# Altium project Proyecto0.PrjPcb (part 1 of 3)
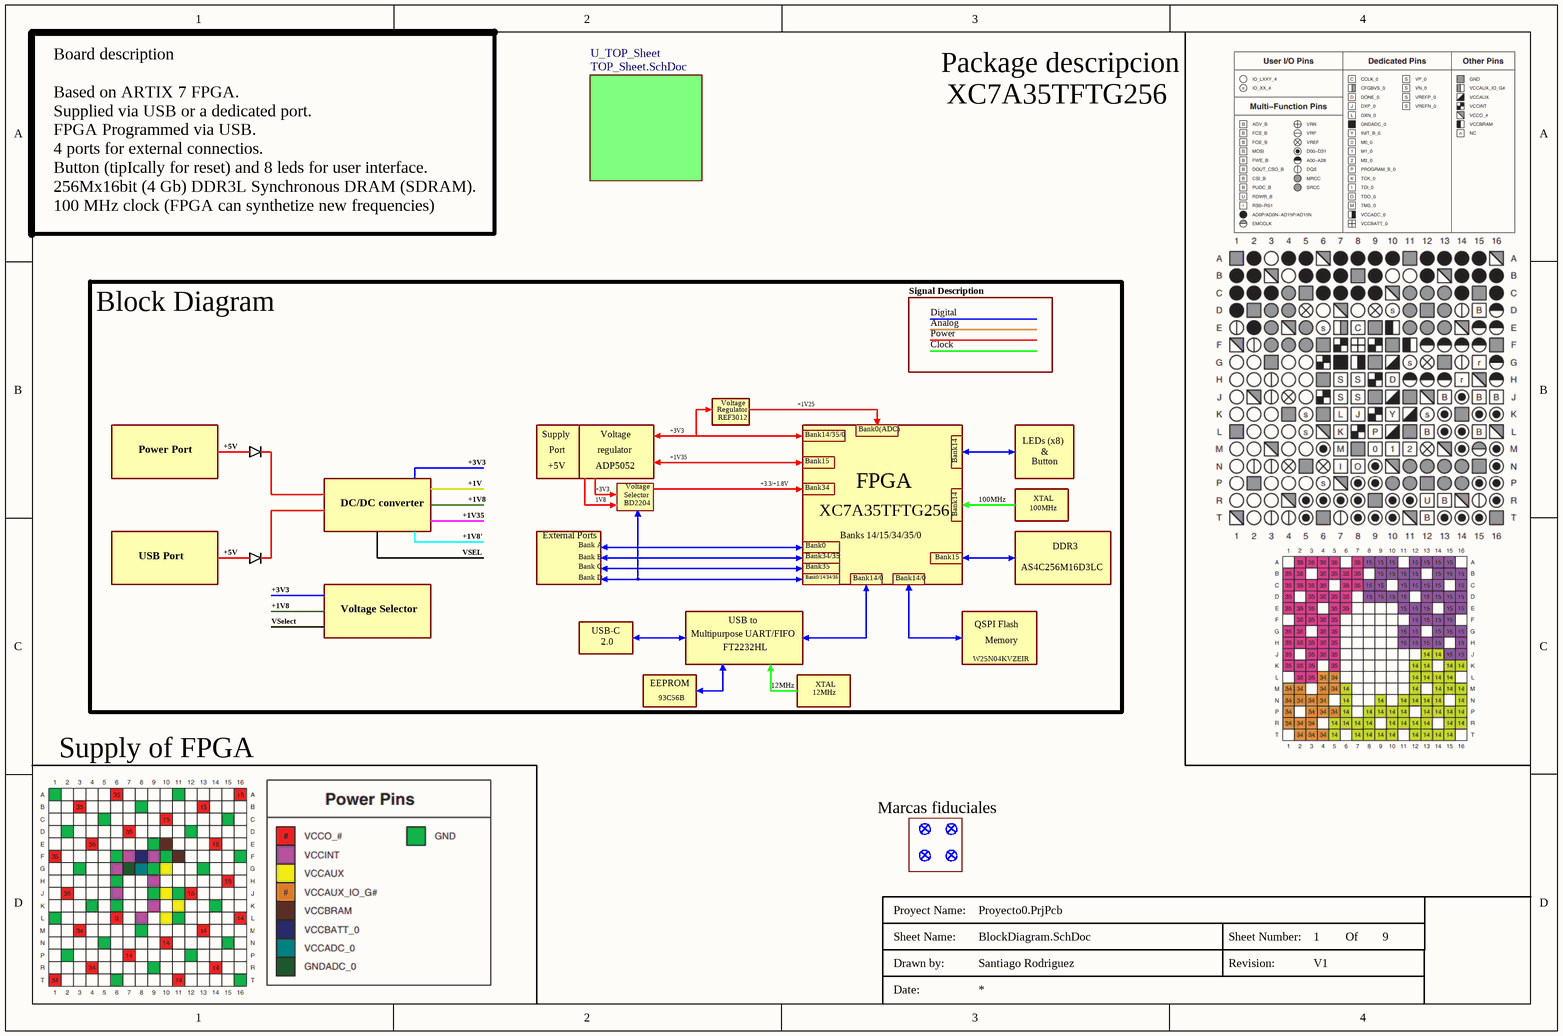
[diagram p0: BlockDiagram.SchDoc]
9 sheets, 188 parts. Net scope: flat (ports and power ports of the same name join across sheets).
Board file: Proyecto_0 - V2.PcbDoc
Sheets:
  BlockDiagram.SchDoc
    U_TOP_Sheet = TOP_Sheet.SchDoc
      U_Bank_A-B-C-D = Bank_A-B-C-D.SchDoc
      U_DDR_Memory = DDR_Memory.SchDoc
      U_Flash_Memory = Flash_Memory.SchDoc
      U_FPGA_Power&Ports = FPGA_Power&Ports.SchDoc
      U_Leds_and_Buttons = Leds_and_Buttons.SchDoc
      U_Power_Supply = Power_Supply.SchDoc
      U_USB_Port_FTT = USB_Port_FTT.SchDoc

## Sheet BlockDiagram.SchDoc
size A4; DrawnBy: Santiago Rodriguez; Revision: V1; SheetNumber: 1; SheetTotal: 9

### Sub-sheets
U_TOP_Sheet = TOP_Sheet.SchDoc: no entries

### Notes on the sheet
- Package descripcion
- XC7A35TFTG256
- Board description
  Based on ARTIX 7 FPGA.
  Supplied via USB or a dedicated port.
  FPGA Programmed via USB.
  4 ports for external connectios.
  Button (tipIcally for reset) and 8 leds for user interface.
  256Mx16bit (4 Gb) DDR3L Synchronous DRAM (SDRAM).
  100 MHz clock (FPGA can synthetize new frequencies)
- Block Diagram
- Signal Description
- Digital
- Power
- Analog
- Clock
- Power Port
- +5V
- Supply
- Port
- regulator
- Voltage
- +3V3
- Regulator
- REF3012
- +1V25
- Bank14/35/0
- Bank0(ADC)
- LEDs (x8)
- DC/DC converter
- +1V35
- +1V
- +1V8
- ADP5052
- 1V8
- Selector
- BD2204
- +3.3/+1.8V
- Bank15
- Bank34
- FPGA
- Bank14
- 100MHz
- Button
- XTAL
- &
- USB Port
- +1V8'
- VSEL
- External Ports
- Bank A
- Bank B
- Bank C
- Bank D
- Bank0
- Bank34/35
- Bank35
- Bank0/14/34/35
- Banks 14/15/34/35/0
- Bank14/0
- AS4C256M16D3LC
- DDR3
- VSelect
- Voltage Selector
- USB-C
- 2.0
- Multipurpose UART/FIFO
- FT2232HL
- USB to
- QSPI Flash
- Memory
- EEPROM
- 93C56B
- 12MHz
- W25N04KVZEIR
- Supply of FPGA
- Marcas fiduciales
- Proyect Name:
- Sheet Name:
- Drawn by:
- Revision:
- Sheet Number:
- Of
- Date:

## Sheet TOP_Sheet.SchDoc
size 431 x 279 mm; DrawnBy: Santiago Rodriguez; Revision: V1; SheetNumber: 2; SheetTotal: 9
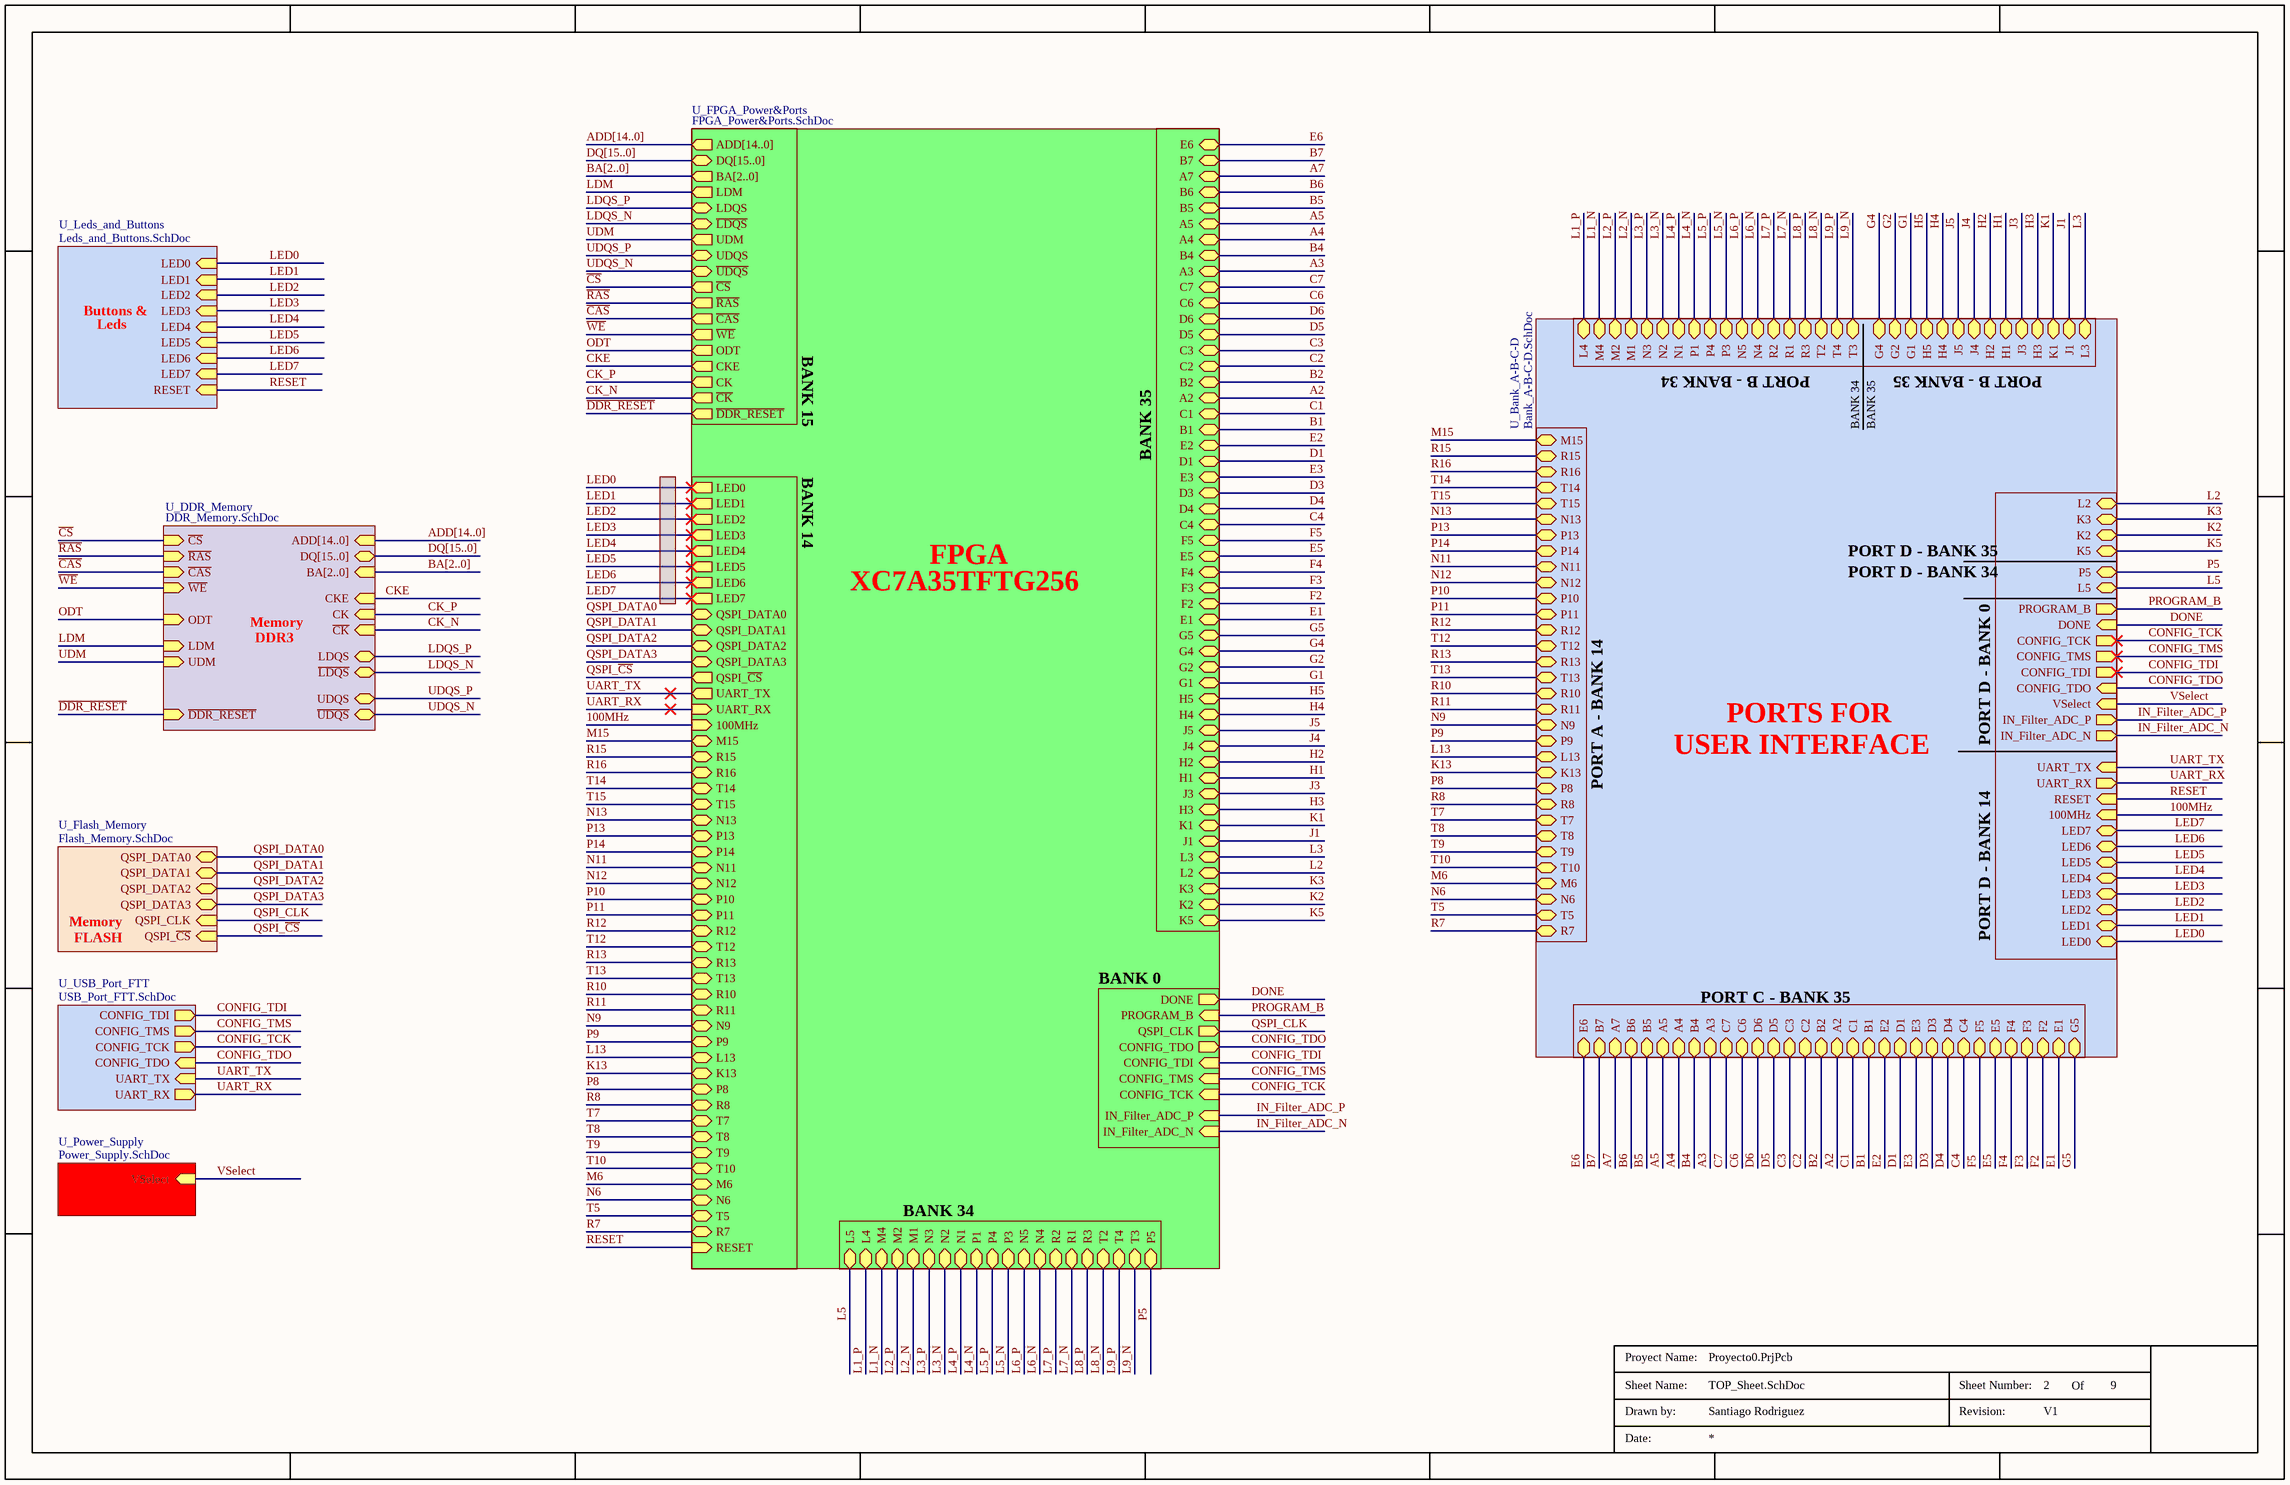
[diagram p1: TOP_Sheet.SchDoc]

### Sub-sheets
U_Bank_A-B-C-D = Bank_A-B-C-D.SchDoc: UART_TX (in), UART_RX (out), LED1 (bidir), LED2 (bidir), LED3 (bidir), LED4 (bidir), LED5 (bidir), LED6 (bidir), LED7 (bidir), 100MHz (in), LED0 (bidir), RESET (in), CONFIG_TDO (in), CONFIG_TDI (out), CONFIG_TMS (out), CONFIG_TCK (out), R1 (bidir), R2 (bidir), R3 (bidir), N1 (bidir), N2 (bidir), N3 (bidir), P1 (bidir), N4 (bidir), N5 (bidir), P3 (bidir), P4 (bidir), M1 (bidir), M2 (bidir), L4 (bidir), L5 (bidir), M4 (bidir), T2 (bidir), T3 (bidir), T4 (bidir), P5 (bidir), E6 (bidir), B7 (bidir), A7 (bidir), B5 (bidir), B6 (bidir), A4 (bidir), A5 (bidir), B4 (bidir), A3 (bidir), C1 (bidir), D1 (bidir), D3 (bidir), D4 (bidir), C2 (bidir), C3 (bidir), C4 (bidir), E5 (bidir), F4 (bidir), F5 (bidir), F2 (bidir), F3 (bidir), G1 (bidir), G2 (bidir), E1 (bidir), G4 (bidir), G5 (bidir), E2 (bidir), E3 (bidir), B1 (bidir), B2 (bidir), A2 (bidir), C6 (bidir), C7 (bidir), D5 (bidir), D6 (bidir), J1 (bidir), K1 (bidir), H1 (bidir), H2 (bidir), L2 (bidir), L3 (bidir), K2 (bidir), K3 (bidir), K5 (bidir), H3 (bidir), H4 (bidir), H5 (bidir), J3 (bidir), J4 (bidir), J5 (bidir), DONE (in), PROGRAM_B (out), IN_Filter_ADC_P (out), IN_Filter_ADC_N (out), VSelect (in), K13 (bidir), R15 (bidir), R16 (bidir), T14 (bidir), T15 (bidir), N13 (bidir), P13 (bidir), P14 (bidir), N11 (bidir), N12 (bidir), P10 (bidir), P11 (bidir), R12 (bidir), T12 (bidir), R13 (bidir), T13 (bidir), R10 (bidir), R11 (bidir), N9 (bidir), P9 (bidir), M6 (bidir), L13 (bidir), P8 (bidir), R8 (bidir), T7 (bidir), T8 (bidir), T9 (bidir), T10 (bidir), T5 (bidir), N6 (bidir), M15 (bidir), R7 (bidir)
U_DDR_Memory = DDR_Memory.SchDoc: CKE (in), ~{CK} (in), CK (in), ~{CS} (in), ~{RAS} (in), ~{CAS} (in), ~{WE} (in), ADD[14..0] (in), DQ[15..0] (bidir), LDQS (bidir), ~{LDQS} (bidir), UDQS (bidir), ~{UDQS} (bidir), ODT (in), ~{DDR_RESET} (in), LDM (in), UDM (in), BA[2..0] (in)
U_Flash_Memory = Flash_Memory.SchDoc: QSPI_DATA0 (bidir), QSPI_DATA1 (bidir), QSPI_DATA2 (bidir), QSPI_DATA3 (bidir), QSPI_CLK (in), QSPI_~{CS} (in)
U_FPGA_Power&Ports = FPGA_Power&Ports.SchDoc: QSPI_DATA0 (bidir), QSPI_DATA1 (bidir), QSPI_DATA2 (bidir), QSPI_DATA3 (bidir), QSPI_~{CS} (out), UART_TX (out), UART_RX (in), LED1 (out), LED2 (out), LED3 (out), LED4 (out), LED5 (out), LED6 (out), LED7 (out), K13 (bidir), 100MHz (in), R15 (bidir), R16 (bidir), T14 (bidir), T15 (bidir), N13 (bidir), P13 (bidir), P14 (bidir), N11 (bidir), N12 (bidir), P10 (bidir), P11 (bidir), R12 (bidir), T12 (bidir), R13 (bidir), T13 (bidir), R10 (bidir), R11 (bidir), N9 (bidir), P9 (bidir), M6 (bidir), L13 (bidir), P8 (bidir), R8 (bidir), T7 (bidir), T8 (bidir), T9 (bidir), T10 (bidir), T5 (bidir), N6 (bidir), M15 (bidir), R7 (bidir), RESET (in), ODT (out), ~{DDR_RESET} (out), ADD[14..0] (out), BA[2..0] (out), CKE (out), ~{CK} (out), CK (out), ~{CS} (out), ~{RAS} (out), ~{CAS} (out), ~{WE} (out), E6 (bidir), B7 (bidir), A7 (bidir), B5 (bidir), B6 (bidir), A4 (bidir), A5 (bidir), B4 (bidir), A3 (bidir), C1 (bidir), D1 (bidir), D3 (bidir), D4 (bidir), C2 (bidir), C3 (bidir), C4 (bidir), E5 (bidir), F4 (bidir), F5 (bidir), F2 (bidir), F3 (bidir), G1 (bidir), G2 (bidir), E1 (bidir), G4 (bidir), G5 (bidir), E2 (bidir), E3 (bidir), B1 (bidir), B2 (bidir), A2 (bidir), C6 (bidir), C7 (bidir), D5 (bidir), D6 (bidir), J1 (bidir), K1 (bidir), H1 (bidir), H2 (bidir), L2 (bidir), L3 (bidir), K2 (bidir), K3 (bidir), K5 (bidir), H3 (bidir), H4 (bidir), H5 (bidir), J3 (bidir), J4 (bidir), J5 (bidir), DQ[15..0] (bidir), LDQS (bidir), ~{LDQS} (bidir), UDQS (bidir), ~{UDQS} (bidir), UDM (out), LDM (out), LED0 (out), R1 (bidir), R2 (bidir), R3 (bidir), N1 (bidir), N2 (bidir), N3 (bidir), P1 (bidir), N4 (bidir), N5 (bidir), P3 (bidir), P4 (bidir), M1 (bidir), M2 (bidir), L4 (bidir), L5 (bidir), M4 (bidir), T2 (bidir), T3 (bidir), T4 (bidir), P5 (bidir), CONFIG_TDO (out), CONFIG_TDI (in), CONFIG_TMS (in), CONFIG_TCK (in), QSPI_CLK (out), DONE (out), PROGRAM_B (in), IN_Filter_ADC_P (in), IN_Filter_ADC_N (in)
U_Leds_and_Buttons = Leds_and_Buttons.SchDoc: LED0 (in), LED1 (in), LED2 (in), LED3 (in), LED4 (in), LED5 (in), LED6 (in), LED7 (in), RESET (in)
U_Power_Supply = Power_Supply.SchDoc: VSelect (in)
U_USB_Port_FTT = USB_Port_FTT.SchDoc: CONFIG_TDO (in), CONFIG_TDI (out), CONFIG_TMS (out), CONFIG_TCK (out), UART_TX (in), UART_RX (out)

### Nets
100MHz: sheet U_Bank_A-B-C-D/100MHz, sheet U_FPGA_Power&Ports/100MHz
A2: sheet U_Bank_A-B-C-D/A2, sheet U_FPGA_Power&Ports/A2
A3: sheet U_Bank_A-B-C-D/A3, sheet U_FPGA_Power&Ports/A3
A4: sheet U_Bank_A-B-C-D/A4, sheet U_FPGA_Power&Ports/A4
A5: sheet U_Bank_A-B-C-D/A5, sheet U_FPGA_Power&Ports/A5
A7: sheet U_Bank_A-B-C-D/A7, sheet U_FPGA_Power&Ports/A7
B1: sheet U_Bank_A-B-C-D/B1, sheet U_FPGA_Power&Ports/B1
B2: sheet U_Bank_A-B-C-D/B2, sheet U_FPGA_Power&Ports/B2
B4: sheet U_Bank_A-B-C-D/B4, sheet U_FPGA_Power&Ports/B4
B5: sheet U_Bank_A-B-C-D/B5, sheet U_FPGA_Power&Ports/B5
B6: sheet U_Bank_A-B-C-D/B6, sheet U_FPGA_Power&Ports/B6
B7: sheet U_Bank_A-B-C-D/B7, sheet U_FPGA_Power&Ports/B7
C1: sheet U_Bank_A-B-C-D/C1, sheet U_FPGA_Power&Ports/C1
C2: sheet U_Bank_A-B-C-D/C2, sheet U_FPGA_Power&Ports/C2
C3: sheet U_Bank_A-B-C-D/C3, sheet U_FPGA_Power&Ports/C3
C4: sheet U_Bank_A-B-C-D/C4, sheet U_FPGA_Power&Ports/C4
C6: sheet U_Bank_A-B-C-D/C6, sheet U_FPGA_Power&Ports/C6
C7: sheet U_Bank_A-B-C-D/C7, sheet U_FPGA_Power&Ports/C7
~{CAS}: sheet U_DDR_Memory/~{CAS}, sheet U_FPGA_Power&Ports/~{CAS}
~{CS}: sheet U_DDR_Memory/~{CS}, sheet U_FPGA_Power&Ports/~{CS}
CK_N: sheet U_DDR_Memory/~{CK}, sheet U_FPGA_Power&Ports/~{CK}
CK_P: sheet U_DDR_Memory/CK, sheet U_FPGA_Power&Ports/CK
CKE: sheet U_DDR_Memory/CKE, sheet U_FPGA_Power&Ports/CKE
CONFIG_TCK: sheet U_Bank_A-B-C-D/CONFIG_TCK, sheet U_FPGA_Power&Ports/CONFIG_TCK, sheet U_USB_Port_FTT/CONFIG_TCK
CONFIG_TDI: sheet U_Bank_A-B-C-D/CONFIG_TDI, sheet U_FPGA_Power&Ports/CONFIG_TDI, sheet U_USB_Port_FTT/CONFIG_TDI
CONFIG_TDO: sheet U_Bank_A-B-C-D/CONFIG_TDO, sheet U_FPGA_Power&Ports/CONFIG_TDO, sheet U_USB_Port_FTT/CONFIG_TDO
CONFIG_TMS: sheet U_Bank_A-B-C-D/CONFIG_TMS, sheet U_FPGA_Power&Ports/CONFIG_TMS, sheet U_USB_Port_FTT/CONFIG_TMS
D1: sheet U_Bank_A-B-C-D/D1, sheet U_FPGA_Power&Ports/D1
D3: sheet U_Bank_A-B-C-D/D3, sheet U_FPGA_Power&Ports/D3
D4: sheet U_Bank_A-B-C-D/D4, sheet U_FPGA_Power&Ports/D4
D5: sheet U_Bank_A-B-C-D/D5, sheet U_FPGA_Power&Ports/D5
D6: sheet U_Bank_A-B-C-D/D6, sheet U_FPGA_Power&Ports/D6
~{DDR_RESET}: sheet U_DDR_Memory/~{DDR_RESET}, sheet U_FPGA_Power&Ports/~{DDR_RESET}
DONE: sheet U_Bank_A-B-C-D/DONE, sheet U_FPGA_Power&Ports/DONE
E1: sheet U_Bank_A-B-C-D/E1, sheet U_FPGA_Power&Ports/E1
E2: sheet U_Bank_A-B-C-D/E2, sheet U_FPGA_Power&Ports/E2
E3: sheet U_Bank_A-B-C-D/E3, sheet U_FPGA_Power&Ports/E3
E5: sheet U_Bank_A-B-C-D/E5, sheet U_FPGA_Power&Ports/E5
E6: sheet U_Bank_A-B-C-D/E6, sheet U_FPGA_Power&Ports/E6
F2: sheet U_Bank_A-B-C-D/F2, sheet U_FPGA_Power&Ports/F2
F3: sheet U_Bank_A-B-C-D/F3, sheet U_FPGA_Power&Ports/F3
F4: sheet U_Bank_A-B-C-D/F4, sheet U_FPGA_Power&Ports/F4
F5: sheet U_Bank_A-B-C-D/F5, sheet U_FPGA_Power&Ports/F5
G1: sheet U_Bank_A-B-C-D/G1, sheet U_FPGA_Power&Ports/G1
G2: sheet U_Bank_A-B-C-D/G2, sheet U_FPGA_Power&Ports/G2
G4: sheet U_Bank_A-B-C-D/G4, sheet U_FPGA_Power&Ports/G4
G5: sheet U_Bank_A-B-C-D/G5, sheet U_FPGA_Power&Ports/G5
H1: sheet U_Bank_A-B-C-D/H1, sheet U_FPGA_Power&Ports/H1
H2: sheet U_Bank_A-B-C-D/H2, sheet U_FPGA_Power&Ports/H2
H3: sheet U_Bank_A-B-C-D/H3, sheet U_FPGA_Power&Ports/H3
H4: sheet U_Bank_A-B-C-D/H4, sheet U_FPGA_Power&Ports/H4
H5: sheet U_Bank_A-B-C-D/H5, sheet U_FPGA_Power&Ports/H5
IN_Filter_ADC_N: sheet U_Bank_A-B-C-D/IN_Filter_ADC_N, sheet U_FPGA_Power&Ports/IN_Filter_ADC_N
IN_Filter_ADC_P: sheet U_Bank_A-B-C-D/IN_Filter_ADC_P, sheet U_FPGA_Power&Ports/IN_Filter_ADC_P
J1: sheet U_Bank_A-B-C-D/J1, sheet U_FPGA_Power&Ports/J1
J3: sheet U_Bank_A-B-C-D/J3, sheet U_FPGA_Power&Ports/J3
J4: sheet U_Bank_A-B-C-D/J4, sheet U_FPGA_Power&Ports/J4
J5: sheet U_Bank_A-B-C-D/J5, sheet U_FPGA_Power&Ports/J5
K1: sheet U_Bank_A-B-C-D/K1, sheet U_FPGA_Power&Ports/K1
K2: sheet U_Bank_A-B-C-D/K2, sheet U_FPGA_Power&Ports/K2
K3: sheet U_Bank_A-B-C-D/K3, sheet U_FPGA_Power&Ports/K3
K5: sheet U_Bank_A-B-C-D/K5, sheet U_FPGA_Power&Ports/K5
K13: sheet U_Bank_A-B-C-D/K13, sheet U_FPGA_Power&Ports/K13
L1_N: sheet U_Bank_A-B-C-D/M4, sheet U_FPGA_Power&Ports/M4
L1_P: sheet U_Bank_A-B-C-D/L4, sheet U_FPGA_Power&Ports/L4
L2: sheet U_Bank_A-B-C-D/L2, sheet U_FPGA_Power&Ports/L2
L2_N: sheet U_Bank_A-B-C-D/M1, sheet U_FPGA_Power&Ports/M1
L2_P: sheet U_Bank_A-B-C-D/M2, sheet U_FPGA_Power&Ports/M2
L3: sheet U_Bank_A-B-C-D/L3, sheet U_FPGA_Power&Ports/L3
L3_N: sheet U_Bank_A-B-C-D/N2, sheet U_FPGA_Power&Ports/N2
L3_P: sheet U_Bank_A-B-C-D/N3, sheet U_FPGA_Power&Ports/N3
L4_N: sheet U_Bank_A-B-C-D/P1, sheet U_FPGA_Power&Ports/P1
L4_P: sheet U_Bank_A-B-C-D/N1, sheet U_FPGA_Power&Ports/N1
L5: sheet U_Bank_A-B-C-D/L5, sheet U_FPGA_Power&Ports/L5
L5_N: sheet U_Bank_A-B-C-D/P3, sheet U_FPGA_Power&Ports/P3
L5_P: sheet U_Bank_A-B-C-D/P4, sheet U_FPGA_Power&Ports/P4
L6_N: sheet U_Bank_A-B-C-D/N4, sheet U_FPGA_Power&Ports/N4
L6_P: sheet U_Bank_A-B-C-D/N5, sheet U_FPGA_Power&Ports/N5
L7_N: sheet U_Bank_A-B-C-D/R1, sheet U_FPGA_Power&Ports/R1
L7_P: sheet U_Bank_A-B-C-D/R2, sheet U_FPGA_Power&Ports/R2
L8_N: sheet U_Bank_A-B-C-D/T2, sheet U_FPGA_Power&Ports/T2
L8_P: sheet U_Bank_A-B-C-D/R3, sheet U_FPGA_Power&Ports/R3
L9_N: sheet U_Bank_A-B-C-D/T3, sheet U_FPGA_Power&Ports/T3
L9_P: sheet U_Bank_A-B-C-D/T4, sheet U_FPGA_Power&Ports/T4
L13: sheet U_Bank_A-B-C-D/L13, sheet U_FPGA_Power&Ports/L13
LDM: sheet U_DDR_Memory/LDM, sheet U_FPGA_Power&Ports/LDM
LDQS_N: sheet U_DDR_Memory/~{LDQS}, sheet U_FPGA_Power&Ports/~{LDQS}
LDQS_P: sheet U_DDR_Memory/LDQS, sheet U_FPGA_Power&Ports/LDQS
LED0: sheet U_Bank_A-B-C-D/LED0, sheet U_FPGA_Power&Ports/LED0, sheet U_Leds_and_Buttons/LED0
LED1: sheet U_Bank_A-B-C-D/LED1, sheet U_FPGA_Power&Ports/LED1
LED2: sheet U_Bank_A-B-C-D/LED2, sheet U_FPGA_Power&Ports/LED2, sheet U_Leds_and_Buttons/LED2
LED3: sheet U_Bank_A-B-C-D/LED3, sheet U_FPGA_Power&Ports/LED3, sheet U_Leds_and_Buttons/LED3
LED4: sheet U_Bank_A-B-C-D/LED4, sheet U_FPGA_Power&Ports/LED4, sheet U_Leds_and_Buttons/LED4
LED5: sheet U_Bank_A-B-C-D/LED5, sheet U_FPGA_Power&Ports/LED5, sheet U_Leds_and_Buttons/LED5
LED6: sheet U_Bank_A-B-C-D/LED6, sheet U_FPGA_Power&Ports/LED6, sheet U_Leds_and_Buttons/LED6
LED7: sheet U_Bank_A-B-C-D/LED7, sheet U_FPGA_Power&Ports/LED7, sheet U_Leds_and_Buttons/LED7
M6: sheet U_Bank_A-B-C-D/M6, sheet U_FPGA_Power&Ports/M6
M15: sheet U_Bank_A-B-C-D/M15, sheet U_FPGA_Power&Ports/M15
N6: sheet U_Bank_A-B-C-D/N6, sheet U_FPGA_Power&Ports/N6
N9: sheet U_Bank_A-B-C-D/N9, sheet U_FPGA_Power&Ports/N9
N11: sheet U_Bank_A-B-C-D/N11, sheet U_FPGA_Power&Ports/N11
N12: sheet U_Bank_A-B-C-D/N12, sheet U_FPGA_Power&Ports/N12
N13: sheet U_Bank_A-B-C-D/N13, sheet U_FPGA_Power&Ports/N13
ODT: sheet U_DDR_Memory/ODT, sheet U_FPGA_Power&Ports/ODT
P5: sheet U_Bank_A-B-C-D/P5, sheet U_FPGA_Power&Ports/P5
P8: sheet U_Bank_A-B-C-D/P8, sheet U_FPGA_Power&Ports/P8
P9: sheet U_Bank_A-B-C-D/P9, sheet U_FPGA_Power&Ports/P9
P10: sheet U_Bank_A-B-C-D/P10, sheet U_FPGA_Power&Ports/P10
P11: sheet U_Bank_A-B-C-D/P11, sheet U_FPGA_Power&Ports/P11
P13: sheet U_Bank_A-B-C-D/P13, sheet U_FPGA_Power&Ports/P13
P14: sheet U_Bank_A-B-C-D/P14, sheet U_FPGA_Power&Ports/P14
PROGRAM_B: sheet U_Bank_A-B-C-D/PROGRAM_B, sheet U_FPGA_Power&Ports/PROGRAM_B
QSPI_~{CS}: sheet U_Flash_Memory/QSPI_~{CS}, sheet U_FPGA_Power&Ports/QSPI_~{CS}
QSPI_CLK: sheet U_Flash_Memory/QSPI_CLK, sheet U_FPGA_Power&Ports/QSPI_CLK
QSPI_DATA0: sheet U_Flash_Memory/QSPI_DATA0, sheet U_FPGA_Power&Ports/QSPI_DATA0
QSPI_DATA1: sheet U_Flash_Memory/QSPI_DATA1, sheet U_FPGA_Power&Ports/QSPI_DATA1
QSPI_DATA2: sheet U_Flash_Memory/QSPI_DATA2, sheet U_FPGA_Power&Ports/QSPI_DATA2
QSPI_DATA3: sheet U_Flash_Memory/QSPI_DATA3, sheet U_FPGA_Power&Ports/QSPI_DATA3
R7: sheet U_Bank_A-B-C-D/R7, sheet U_FPGA_Power&Ports/R7
R8: sheet U_Bank_A-B-C-D/R8, sheet U_FPGA_Power&Ports/R8
R10: sheet U_Bank_A-B-C-D/R10, sheet U_FPGA_Power&Ports/R10
R11: sheet U_Bank_A-B-C-D/R11, sheet U_FPGA_Power&Ports/R11
R12: sheet U_Bank_A-B-C-D/R12, sheet U_FPGA_Power&Ports/R12
R13: sheet U_Bank_A-B-C-D/R13, sheet U_FPGA_Power&Ports/R13
R15: sheet U_Bank_A-B-C-D/R15, sheet U_FPGA_Power&Ports/R15
R16: sheet U_Bank_A-B-C-D/R16, sheet U_FPGA_Power&Ports/R16
~{RAS}: sheet U_DDR_Memory/~{RAS}, sheet U_FPGA_Power&Ports/~{RAS}
RESET: sheet U_Bank_A-B-C-D/RESET, sheet U_FPGA_Power&Ports/RESET, sheet U_Leds_and_Buttons/RESET
T5: sheet U_Bank_A-B-C-D/T5, sheet U_FPGA_Power&Ports/T5
T7: sheet U_Bank_A-B-C-D/T7, sheet U_FPGA_Power&Ports/T7
T8: sheet U_Bank_A-B-C-D/T8, sheet U_FPGA_Power&Ports/T8
T9: sheet U_Bank_A-B-C-D/T9, sheet U_FPGA_Power&Ports/T9
T10: sheet U_Bank_A-B-C-D/T10, sheet U_FPGA_Power&Ports/T10
T12: sheet U_Bank_A-B-C-D/T12, sheet U_FPGA_Power&Ports/T12
T13: sheet U_Bank_A-B-C-D/T13, sheet U_FPGA_Power&Ports/T13
T14: sheet U_Bank_A-B-C-D/T14, sheet U_FPGA_Power&Ports/T14
T15: sheet U_Bank_A-B-C-D/T15, sheet U_FPGA_Power&Ports/T15
UART_RX: sheet U_Bank_A-B-C-D/UART_RX, sheet U_FPGA_Power&Ports/UART_RX, sheet U_USB_Port_FTT/UART_RX
UART_TX: sheet U_Bank_A-B-C-D/UART_TX, sheet U_FPGA_Power&Ports/UART_TX, sheet U_USB_Port_FTT/UART_TX
UDM: sheet U_DDR_Memory/UDM, sheet U_FPGA_Power&Ports/UDM
UDQS_N: sheet U_DDR_Memory/~{UDQS}, sheet U_FPGA_Power&Ports/~{UDQS}
UDQS_P: sheet U_DDR_Memory/UDQS, sheet U_FPGA_Power&Ports/UDQS
VSelect: sheet U_Bank_A-B-C-D/VSelect, sheet U_Power_Supply/VSelect
~{WE}: sheet U_DDR_Memory/~{WE}, sheet U_FPGA_Power&Ports/~{WE}

### Buses and harness runs
bus ADD[14..0] = sheet U_DDR_Memory/ADD[14..0]
bus ADD[14..0] = sheet U_FPGA_Power&Ports/ADD[14..0]
bus BA[2..0] = sheet U_DDR_Memory/BA[2..0]
bus BA[2..0] = sheet U_FPGA_Power&Ports/BA[2..0]
bus DQ[15..0] = sheet U_DDR_Memory/DQ[15..0]
bus DQ[15..0] = sheet U_FPGA_Power&Ports/DQ[15..0]

### Notes on the sheet
- Buttons &
- Leds
- BANK 15
- PORT B - BANK 34
- PORT B - BANK 35
- BANK 34
- BANK 35
- BANK 14
- FPGA
- PORT D - BANK 35
- Memory
- XC7A35TFTG256
- PORT D - BANK 34
- DDR3
- USER INTERFACE
- PORTS FOR
- PORT D - BANK 0
- PORT A - BANK 14
- FLASH
- PORT D - BANK 14
- BANK 0
- PORT C - BANK 35
- Proyect Name:
- Sheet Name:
- Drawn by:
- Revision:
- Sheet Number:
- Of
- Date:

## Sheet Bank_A-B-C-D.SchDoc
size 431 x 279 mm; DrawnBy: Santiago Rodriguez; Revision: V1; SheetNumber: 9; SheetTotal: 9
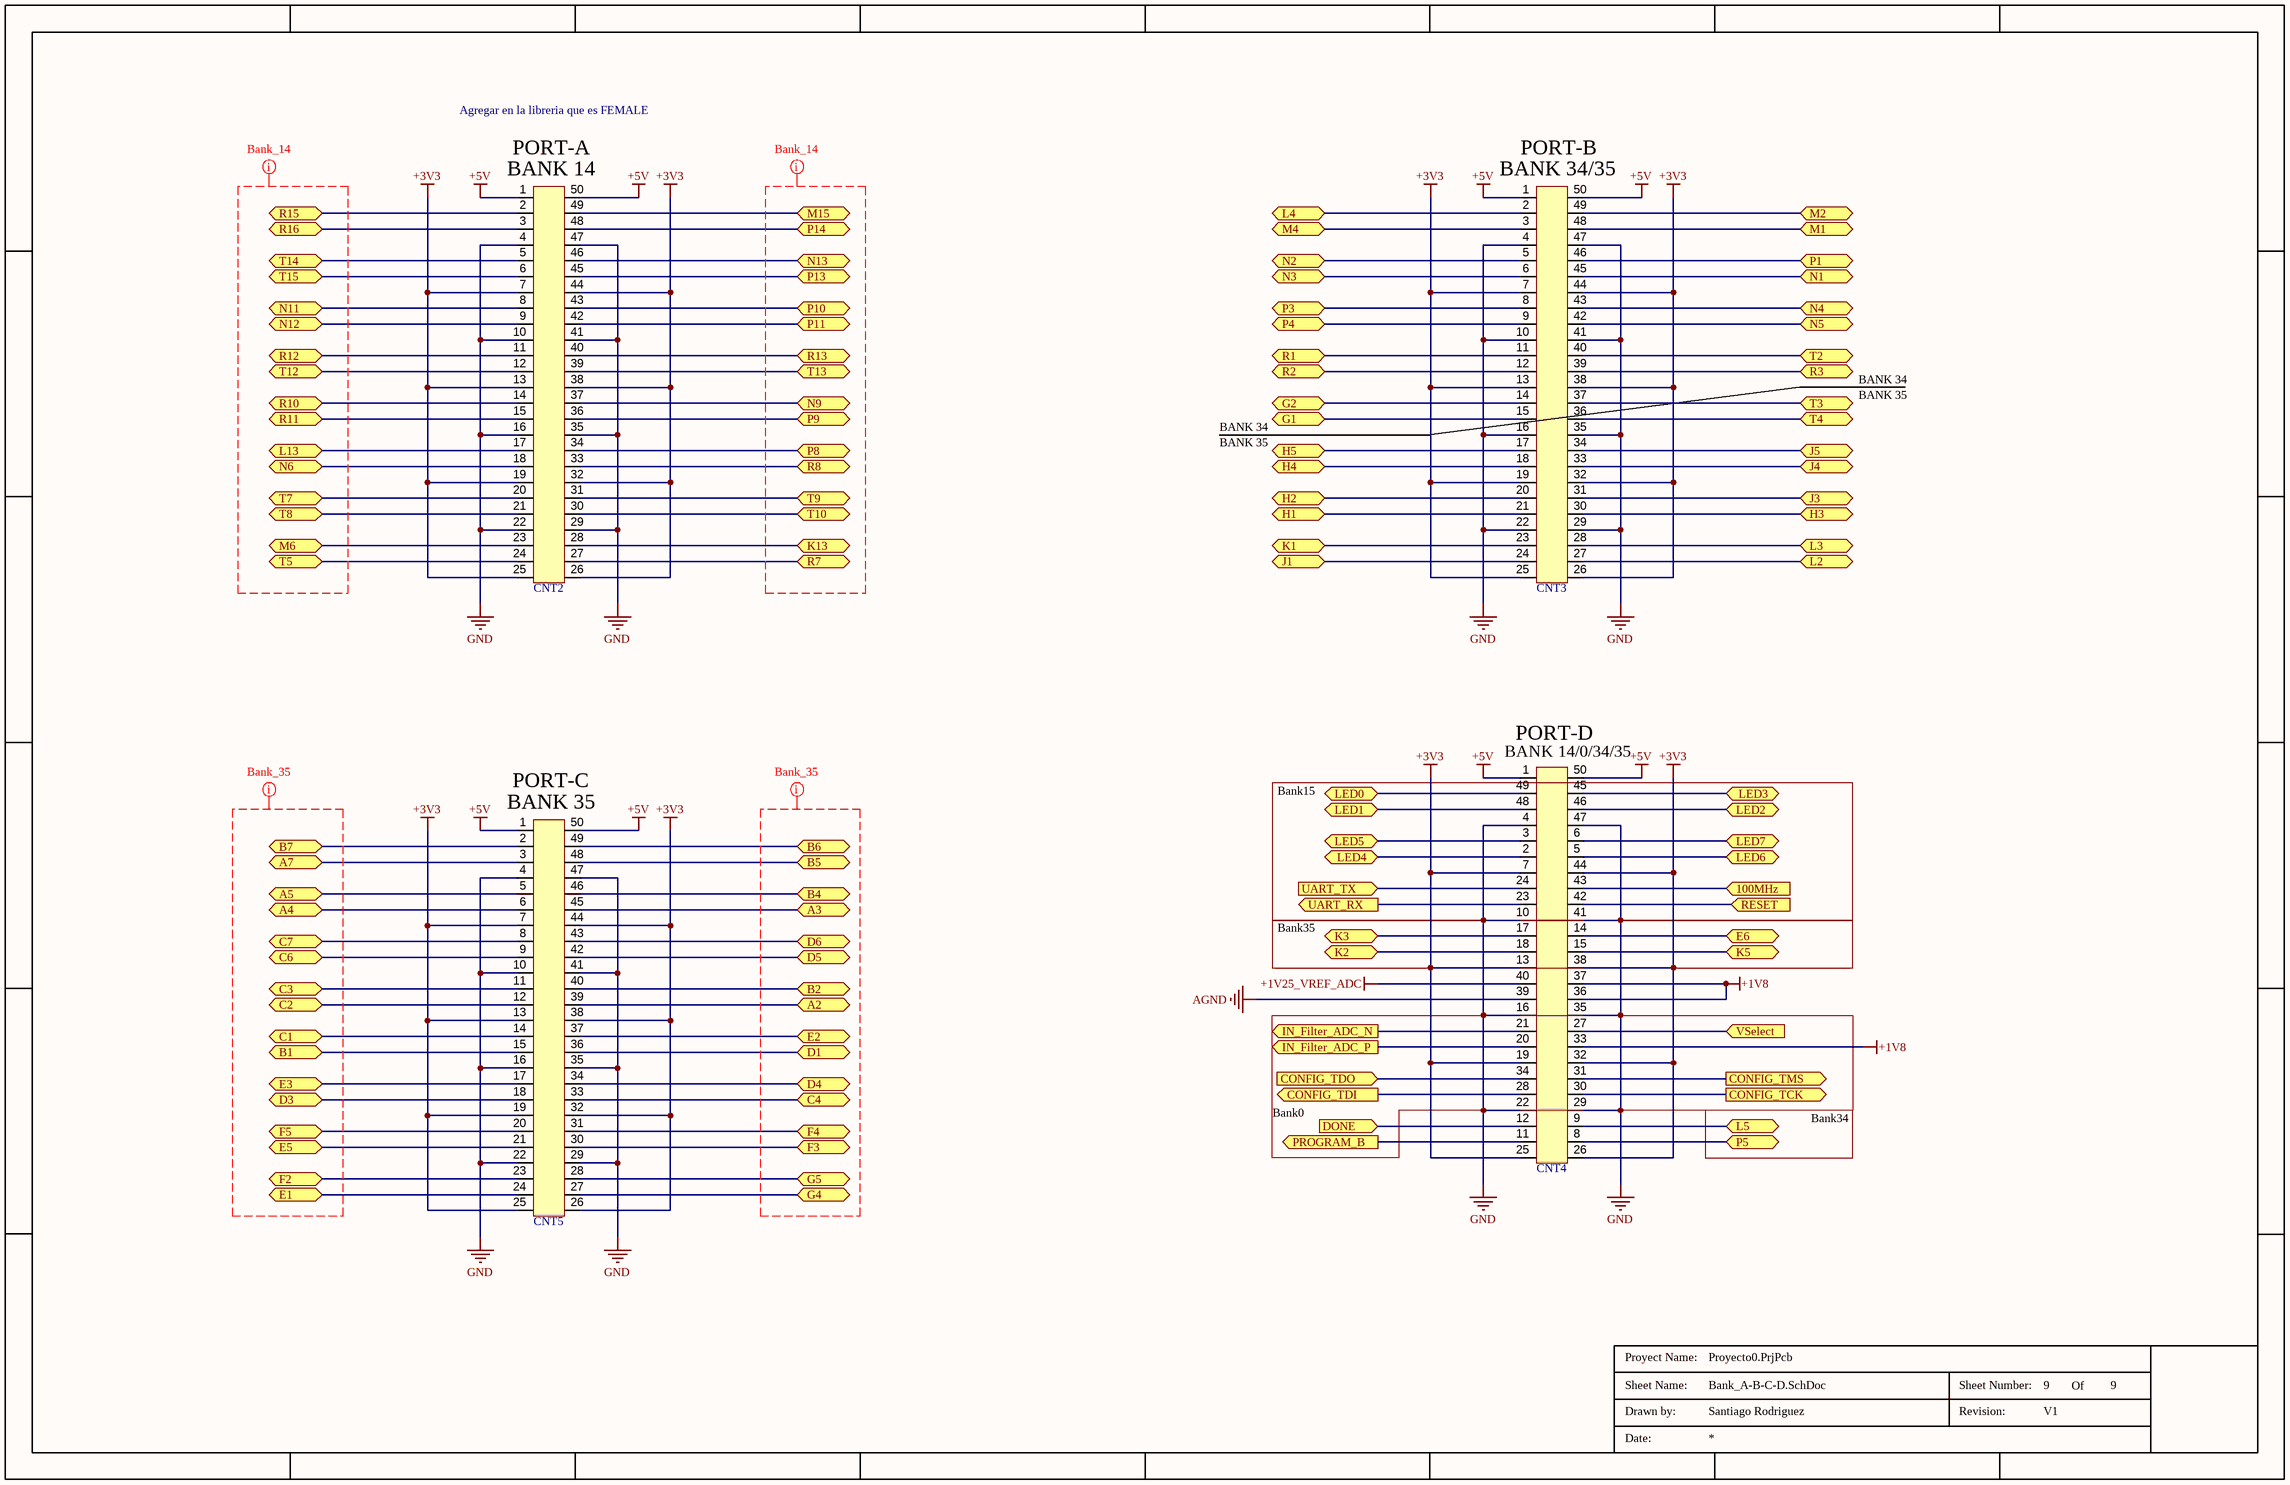
[diagram p2: Bank_A-B-C-D.SchDoc]

### Parts
CNT2  528850574  [528850574]  (value not drawn)
CNT3  528850574  [528850574]  (value not drawn)
CNT4  528850574  [528850574]  (value not drawn)
CNT5  528850574  [528850574]  (value not drawn)

### Ports
100MHz (in), A2 (bidir), A3 (bidir), A4 (bidir), A5 (bidir), A7 (bidir), B1 (bidir), B2 (bidir), B4 (bidir), B5 (bidir), B6 (bidir), B7 (bidir), C1 (bidir), C2 (bidir), C3 (bidir), C4 (bidir), C6 (bidir), C7 (bidir), CONFIG_TCK (out), CONFIG_TDI (out), CONFIG_TDO (in), CONFIG_TMS (out), D1 (bidir), D3 (bidir), D4 (bidir), D5 (bidir), D6 (bidir), DONE (in), E1 (bidir), E2 (bidir), E3 (bidir), E5 (bidir), E6 (bidir), F2 (bidir), F3 (bidir), F4 (bidir), F5 (bidir), G1 (bidir), G2 (bidir), G4 (bidir), G5 (bidir), H1 (bidir), H2 (bidir), H3 (bidir), H4 (bidir), H5 (bidir), IN_Filter_ADC_N (out), IN_Filter_ADC_P (out), J1 (bidir), J3 (bidir), J4 (bidir), J5 (bidir), K1 (bidir), K2 (bidir), K3 (bidir), K5 (bidir), K13 (bidir), L2 (bidir), L3 (bidir), L4 (bidir), L5 (bidir), L13 (bidir), LED0 (bidir), LED1 (bidir), LED2 (bidir), LED3 (bidir), LED4 (bidir), LED5 (bidir), LED6 (bidir), LED7 (bidir), M1 (bidir), M2 (bidir), M4 (bidir), M6 (bidir), M15 (bidir), N1 (bidir), N2 (bidir), N3 (bidir), N4 (bidir), N5 (bidir), N6 (bidir), N9 (bidir), N11 (bidir), N12 (bidir), N13 (bidir), P1 (bidir), P3 (bidir), P4 (bidir), P5 (bidir), P8 (bidir), P9 (bidir), P10 (bidir), P11 (bidir), P13 (bidir), P14 (bidir), PROGRAM_B (out), R1 (bidir), R2 (bidir), R3 (bidir), R7 (bidir), R8 (bidir), R10 (bidir), R11 (bidir), R12 (bidir), R13 (bidir), R15 (bidir), R16 (bidir), RESET (in), T2 (bidir), T3 (bidir), T4 (bidir), T5 (bidir), T7 (bidir), T8 (bidir), T9 (bidir), T10 (bidir), T12 (bidir), T13 (bidir), T14 (bidir), T15 (bidir), UART_RX (out), UART_TX (in), VSelect (in)

### Nets
+1V8: CNT4.33 CNT4.36 CNT4.37
+1V25_VREF_ADC: CNT4.40
+3V3: CNT2.7 CNT2.13 CNT2.19 CNT2.25 CNT2.26 CNT2.32 CNT2.38 CNT2.44 CNT3.7 CNT3.13 CNT3.19 CNT3.25 CNT3.26 CNT3.32 CNT3.38 CNT3.44 CNT4.7 CNT4.13 CNT4.19 CNT4.25 CNT4.26 CNT4.32 CNT4.38 CNT4.44 CNT5.7 CNT5.13 CNT5.19 CNT5.25 CNT5.26 CNT5.32 CNT5.38 CNT5.44
+5V: CNT2.1 CNT2.50 CNT3.1 CNT3.50 CNT4.1 CNT4.50 CNT5.1 CNT5.50
AGND: CNT4.39
GND: CNT2.4 CNT2.10 CNT2.16 CNT2.22 CNT2.29 CNT2.35 CNT2.41 CNT2.47 CNT3.4 CNT3.10 CNT3.16 CNT3.22 CNT3.29 CNT3.35 CNT3.41 CNT3.47 CNT4.4 CNT4.10 CNT4.16 CNT4.22 CNT4.29 CNT4.35 CNT4.41 CNT4.47 CNT5.4 CNT5.10 CNT5.16 CNT5.22 CNT5.29 CNT5.35 CNT5.41 CNT5.47
100MHz: CNT4.43 ; port 100MHz
A2: CNT5.39 ; port A2
A3: CNT5.45 ; port A3
A4: CNT5.6 ; port A4
A5: CNT5.5 ; port A5
A7: CNT5.3 ; port A7
B1: CNT5.15 ; port B1
B2: CNT5.40 ; port B2
B4: CNT5.46 ; port B4
B5: CNT5.48 ; port B5
B6: CNT5.49 ; port B6
B7: CNT5.2 ; port B7
C1: CNT5.14 ; port C1
C2: CNT5.12 ; port C2
C3: CNT5.11 ; port C3
C4: CNT5.33 ; port C4
C6: CNT5.9 ; port C6
C7: CNT5.8 ; port C7
CONFIG_TCK: CNT4.30 ; port CONFIG_TCK
CONFIG_TDI: CNT4.28 ; port CONFIG_TDI
CONFIG_TDO: CNT4.34 ; port CONFIG_TDO
CONFIG_TMS: CNT4.31 ; port CONFIG_TMS
D1: CNT5.36 ; port D1
D3: CNT5.18 ; port D3
D4: CNT5.34 ; port D4
D5: CNT5.42 ; port D5
D6: CNT5.43 ; port D6
DONE: CNT4.12 ; port DONE
E1: CNT5.24 ; port E1
E2: CNT5.37 ; port E2
E3: CNT5.17 ; port E3
E5: CNT5.21 ; port E5
E6: CNT4.14 ; port E6
F2: CNT5.23 ; port F2
F3: CNT5.30 ; port F3
F4: CNT5.31 ; port F4
F5: CNT5.20 ; port F5
G1: CNT3.15 ; port G1
G2: CNT3.14 ; port G2
G4: CNT5.27 ; port G4
G5: CNT5.28 ; port G5
H1: CNT3.21 ; port H1
H2: CNT3.20 ; port H2
H3: CNT3.30 ; port H3
H4: CNT3.18 ; port H4
H5: CNT3.17 ; port H5
IN_Filter_ADC_N: CNT4.21 ; port IN_Filter_ADC_N
IN_Filter_ADC_P: CNT4.20 ; port IN_Filter_ADC_P
J1: CNT3.24 ; port J1
J3: CNT3.31 ; port J3
J4: CNT3.33 ; port J4
J5: CNT3.34 ; port J5
K1: CNT3.23 ; port K1
K2: CNT4.18 ; port K2
K3: CNT4.17 ; port K3
K5: CNT4.15 ; port K5
K13: CNT2.28 ; port K13
L1_N: CNT3.3 ; port M4
L1_P: CNT3.2 ; port L4
L2: CNT3.27 ; port L2
L2_N: CNT3.48 ; port M1
L2_P: CNT3.49 ; port M2
L3: CNT3.28 ; port L3
L3_N: CNT3.5 ; port N2
L3_P: CNT3.6 ; port N3
L4_N: CNT3.46 ; port P1
L4_P: CNT3.45 ; port N1
L5: CNT4.9 ; port L5
L5_N: CNT3.8 ; port P3
L5_P: CNT3.9 ; port P4
L6_N: CNT3.43 ; port N4
L6_P: CNT3.42 ; port N5
L7_N: CNT3.11 ; port R1
L7_P: CNT3.12 ; port R2
L8_N: CNT3.40 ; port T2
L8_P: CNT3.39 ; port R3
L9_N: CNT3.37 ; port T3
L9_P: CNT3.36 ; port T4
L13: CNT2.17 ; port L13
LED0: CNT4.49 ; port LED0
LED1: CNT4.48 ; port LED1
LED2: CNT4.46 ; port LED2
LED3: CNT4.45 ; port LED3
LED4: CNT4.2 ; port LED4
LED5: CNT4.3 ; port LED5
LED6: CNT4.5 ; port LED6
LED7: CNT4.6 ; port LED7
M6: CNT2.23 ; port M6
M15: CNT2.49 ; port M15
N6: CNT2.18 ; port N6
N9: CNT2.37 ; port N9
N11: CNT2.8 ; port N11
N12: CNT2.9 ; port N12
N13: CNT2.46 ; port N13
P5: CNT4.8 ; port P5
P8: CNT2.34 ; port P8
P9: CNT2.36 ; port P9
P10: CNT2.43 ; port P10
P11: CNT2.42 ; port P11
P13: CNT2.45 ; port P13
P14: CNT2.48 ; port P14
PROGRAM_B: CNT4.11 ; port PROGRAM_B
R7: CNT2.27 ; port R7
R8: CNT2.33 ; port R8
R10: CNT2.14 ; port R10
R11: CNT2.15 ; port R11
R12: CNT2.11 ; port R12
R13: CNT2.40 ; port R13
R15: CNT2.2 ; port R15
R16: CNT2.3 ; port R16
RESET: CNT4.42 ; port RESET
T5: CNT2.24 ; port T5
T7: CNT2.20 ; port T7
T8: CNT2.21 ; port T8
T9: CNT2.31 ; port T9
T10: CNT2.30 ; port T10
T12: CNT2.12 ; port T12
T13: CNT2.39 ; port T13
T14: CNT2.5 ; port T14
T15: CNT2.6 ; port T15
UART_RX: CNT4.23 ; port UART_RX
UART_TX: CNT4.24 ; port UART_TX
NetCNT4_27: CNT4.27 ; port VSelect

### Layout directives
net class Bank_14: (no net found under the mark)
net class Bank_35: (no net found under the mark)

### Notes on the sheet
- Agregar en la libreria que es FEMALE
- (near CNT2) PORT-A
- (near CNT3) PORT-B
- (near CNT2) BANK 14
- (near CNT3) BANK 34/35
- BANK 34
- BANK 35
- (near CNT4) BANK 14/0/34/35
- (near CNT4) PORT-D
- (near CNT5) BANK 35
- (near CNT5) PORT-C
- Bank15
- Bank35
- Bank0
- Bank34
- Proyect Name:
- Sheet Name:
- Drawn by:
- Revision:
- Sheet Number:
- Of
- Date:

### Library data of the parts
CNT2-CNT5 = 528850574: CONN RCPT 50POS SMD GOLD; Manufacturer: Molex; Gender: Female; ComponentLink1Description: DigiKey; ComponentLink1URL: https://www.digikey.com/es/products/detail/molex/0528850574/3197085?s=N4IgTCBcDaIAQFYwA5kIAwIOwBYQF0BfIA; ComponentLink2Description: DataSheet; ComponentLink2URL: https://www.molex.com/en-us/products/part-detail/528850574?display=pdf; PinCount: 50

## Sheet DDR_Memory.SchDoc
size 420 x 297 mm; DrawnBy: Santiago Rodriguez; Revision: V1; SheetNumber: 6; SheetTotal: 9
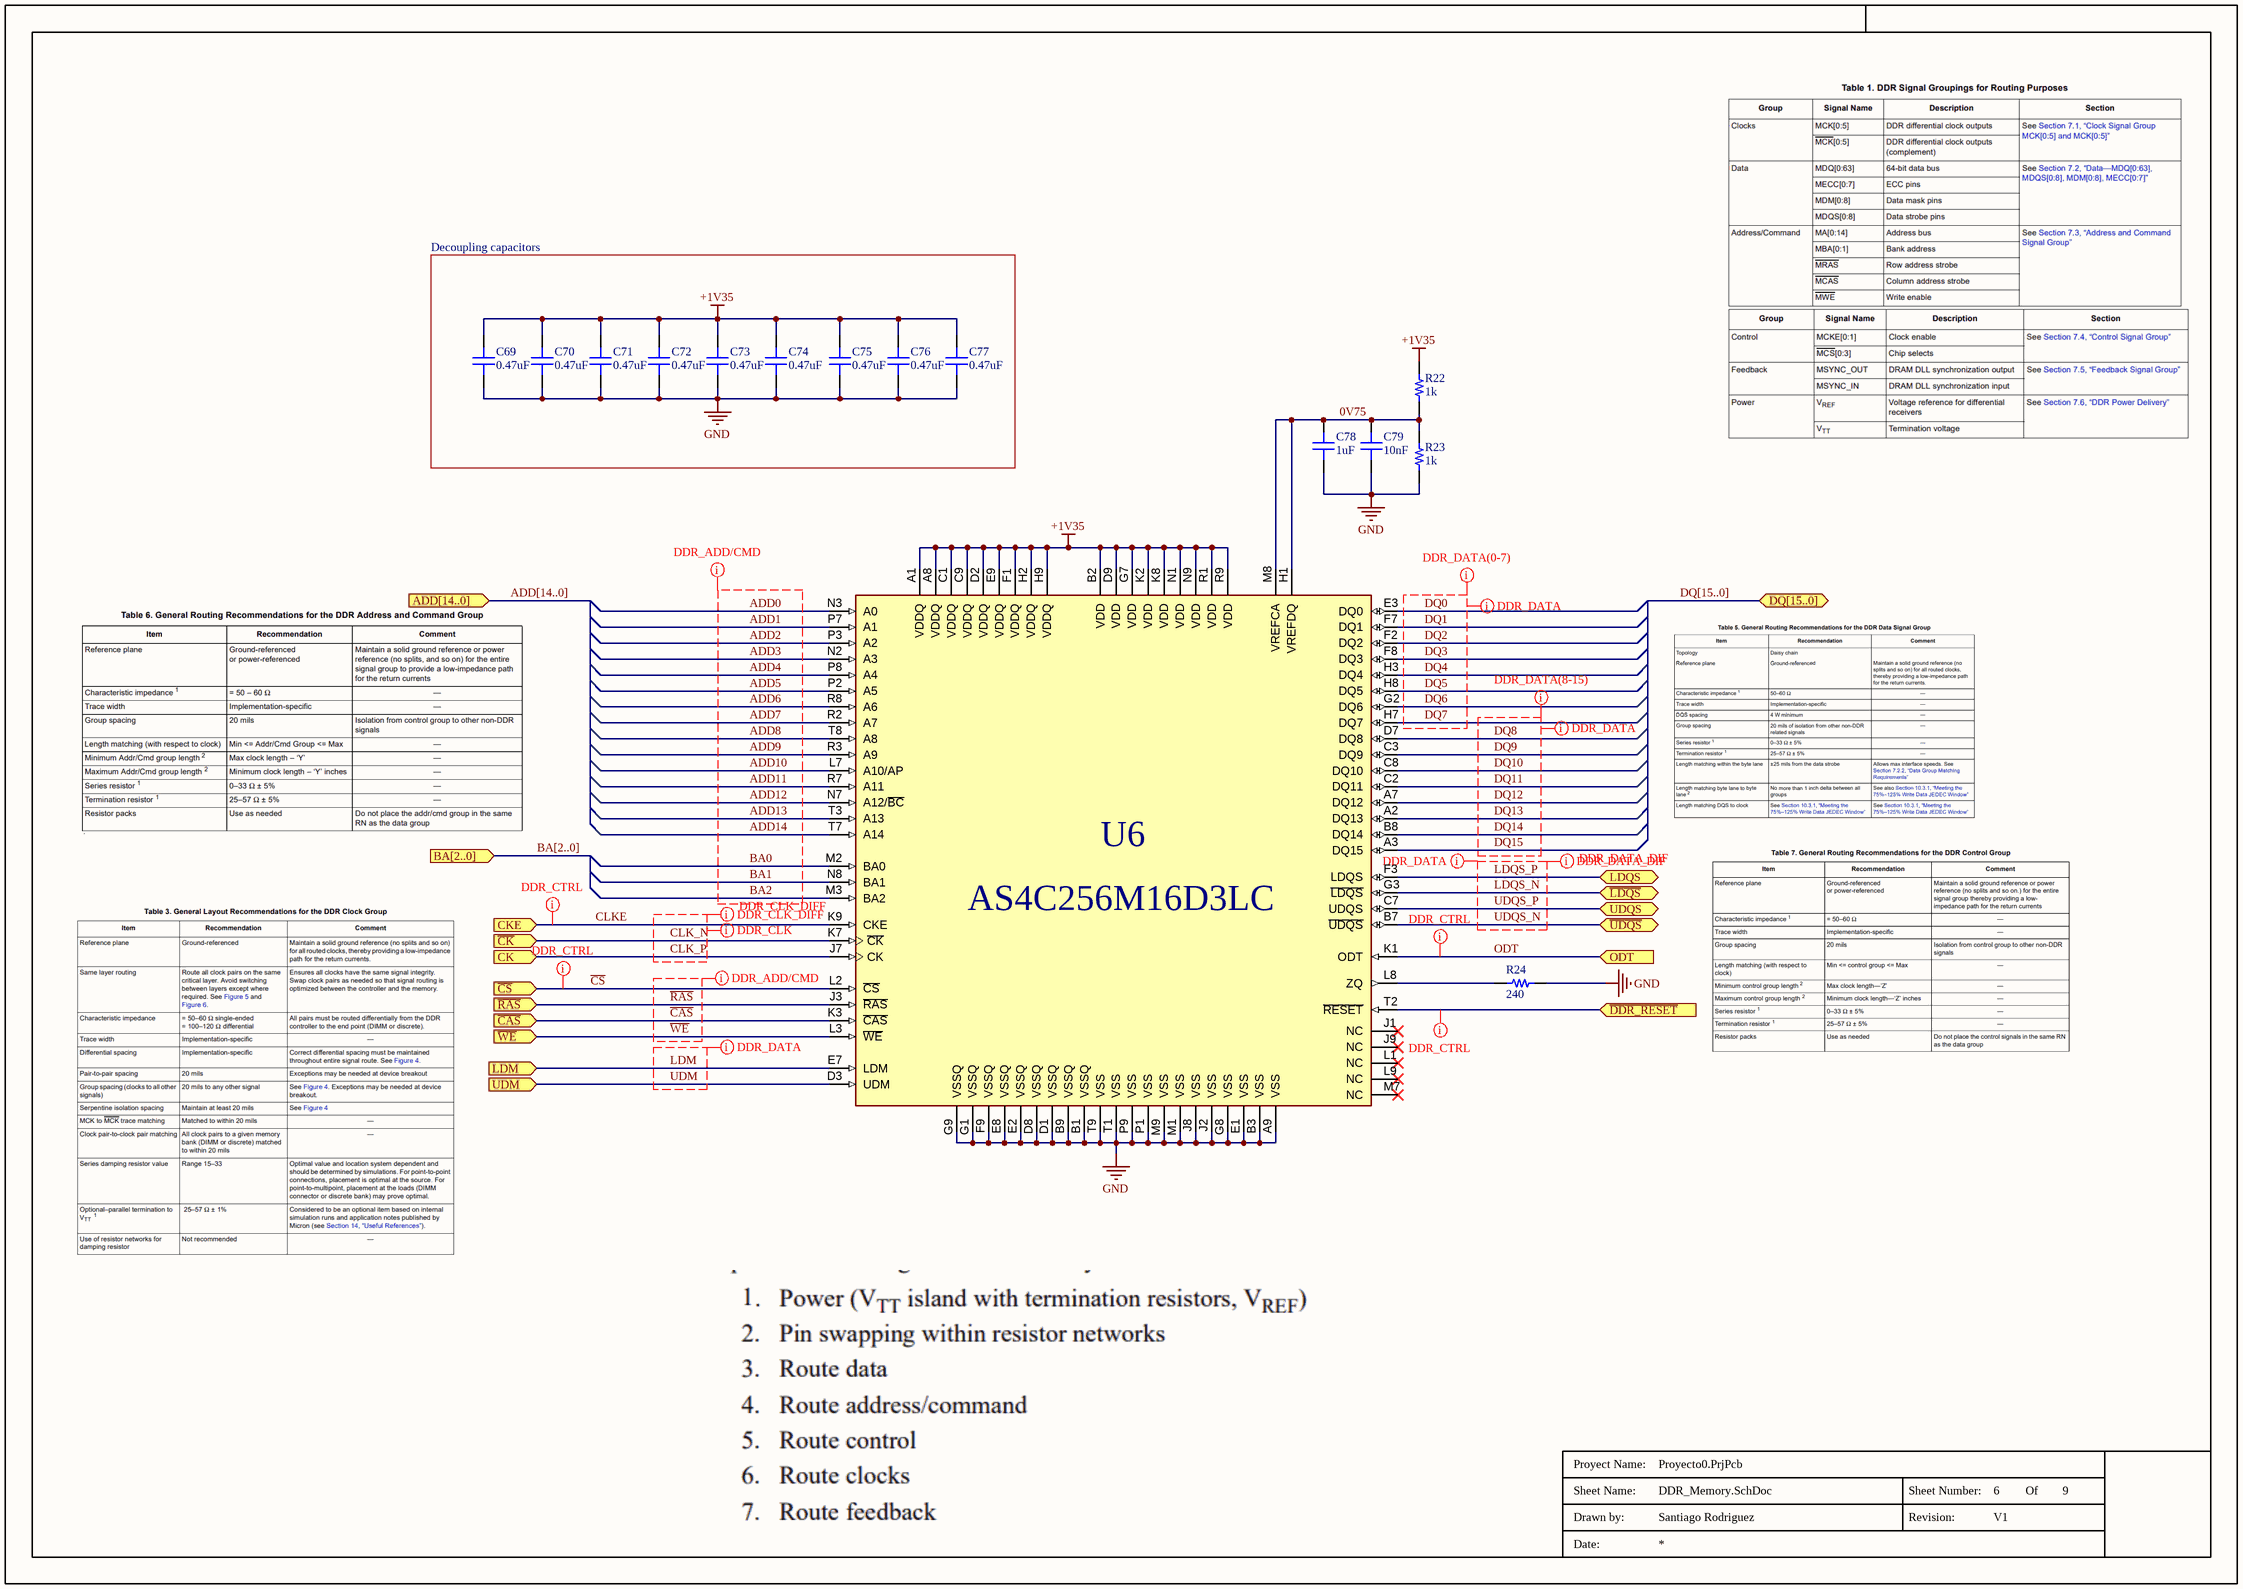
[diagram p3: DDR_Memory.SchDoc]

### Parts
C69  0.47uF  [CAP0402]
C70  0.47uF  [CAP0402]
C71  0.47uF  [CAP0402]
C72  0.47uF  [CAP0402]
C73  0.47uF  [CAP0402]
C74  0.47uF  [CAP0402]
C75  0.47uF  [CAP0402]
C76  0.47uF  [CAP0402]
C77  0.47uF  [CAP0402]
C78  1uF  [CAP0402]
C79  10nF  [CAP0402]
R22  1k  [RES0402]
R23  1k  [RES0402]
R24  240  [RES0402]
U6  AS4C256M16D3LC  [FBGA-96]

### Blocks framed on the sheet
Decoupling capacitors: C69-C77

### Ports
ADD[14..0] (in), BA[2..0] (in), CK (in), CKE (in), DQ[15..0] (bidir), LDM (in), LDQS (bidir), ODT (in), UDM (in), UDQS (bidir), ~{CAS} (in), ~{CK} (in), ~{CS} (in), ~{DDR_RESET} (in), ~{LDQS} (bidir), ~{RAS} (in), ~{UDQS} (bidir), ~{WE} (in)

### Nets
+1V35: C69.2 C70.2 C71.2 C72.2 C73.2 C74.2 C75.2 C76.2 C77.2 R22.2 U6.A1(VDDQ) U6.A8(VDDQ) U6.B2(VDD) U6.C1(VDDQ) U6.C9(VDDQ) U6.D2(VDDQ) U6.D9(VDD) U6.E9(VDDQ) U6.F1(VDDQ) U6.G7(VDD) U6.H2(VDDQ) U6.H9(VDDQ) U6.K2(VDD) U6.K8(VDD) U6.N1(VDD) U6.N9(VDD) U6.R1(VDD) U6.R9(VDD)
GND: C69.1 C70.1 C71.1 C72.1 C73.1 C74.1 C75.1 C76.1 C77.1 C78.1 C79.1 R23.1 R24.2 U6.A9(VSS) U6.B1(VSSQ) U6.B3(VSS) U6.B9(VSSQ) U6.D1(VSSQ) U6.D8(VSSQ) U6.E1(VSS) U6.E2(VSSQ) U6.E8(VSSQ) U6.F9(VSSQ) U6.G1(VSSQ) U6.G8(VSS) U6.G9(VSSQ) U6.J2(VSS) U6.J8(VSS) U6.M1(VSS) U6.M9(VSS) U6.P1(VSS) U6.P9(VSS) U6.T1(VSS) U6.T9(VSS)
0V75: C78.2 C79.2 R22.1 R23.2 U6.H1(VREFDQ) U6.M8(VREFCA)
ADD0: U6.N3(A0)
ADD1: U6.P7(A1)
ADD2: U6.P3(A2)
ADD3: U6.N2(A3)
ADD4: U6.P8(A4)
ADD5: U6.P2(A5)
ADD6: U6.R8(A6)
ADD7: U6.R2(A7)
ADD8: U6.T8(A8)
ADD9: U6.R3(A9)
ADD10: U6.L7(A10/AP)
ADD11: U6.R7(A11)
ADD12: U6.N7(A12/~{BC})
ADD13: U6.T3(A13)
ADD14: U6.T7(A14)
BA0: U6.M2(BA0)
BA1: U6.N8(BA1)
BA2: U6.M3(BA2)
~{CAS}: U6.K3(~{CAS}) ; port ~{CAS}
~{CS}: U6.L2(~{CS}) ; port ~{CS}
CLK_N: U6.K7(~{CK}) ; port ~{CK}  [project net CK_N]
CLK_P: U6.J7(CK) ; port CK  [project net CK_P]
CLKE: U6.K9(CKE) ; port CKE  [project net CKE]
~{DDR_RESET}: U6.T2(~{RESET}) ; port ~{DDR_RESET}
DQ0: U6.E3(DQ0)
DQ1: U6.F7(DQ1)
DQ2: U6.F2(DQ2)
DQ3: U6.F8(DQ3)
DQ4: U6.H3(DQ4)
DQ5: U6.H8(DQ5)
DQ6: U6.G2(DQ6)
DQ7: U6.H7(DQ7)
DQ8: U6.D7(DQ8)
DQ9: U6.C3(DQ9)
DQ10: U6.C8(DQ10)
DQ11: U6.C2(DQ11)
DQ12: U6.A7(DQ12)
DQ13: U6.A2(DQ13)
DQ14: U6.B8(DQ14)
DQ15: U6.A3(DQ15)
LDM: U6.E7(LDM) ; port LDM
LDQS_N: U6.G3(~{LDQS}) ; port ~{LDQS}
LDQS_P: U6.F3(LDQS) ; port LDQS
ODT: U6.K1(ODT) ; port ODT
~{RAS}: U6.J3(~{RAS}) ; port ~{RAS}
UDM: U6.D3(UDM) ; port UDM
UDQS_N: U6.B7(~{UDQS}) ; port ~{UDQS}
UDQS_P: U6.C7(UDQS) ; port UDQS
~{WE}: U6.L3(~{WE}) ; port ~{WE}
NetR24_1: R24.1 U6.L8(ZQ)

Not connected (* = marked no-connect by the designer): U6 J1(NC)* J9(NC)* L1(NC)* L9(NC)* M7(NC)*

### Buses and harness runs
bus ADD[14..0] = port ADD[14..0]
bus BA[2..0] = port BA[2..0]
bus DQ[15..0] = port DQ[15..0]

### Layout directives
net class DDR_ADD/CMD: ADD0, ADD1, ADD2, ADD3, ADD4, ADD5, ADD6, ADD7, ADD8, ADD9, ADD10, ADD11, ADD12, ADD13, ADD14, BA0, BA1, BA2, ~{CAS}, ~{RAS}, ~{WE}
differential pair; differential pair class DDR_CLK_DIFF: CLK_N, CLK_P
net class DDR_CTRL: CKE, ODT, ~{CS}, ~{DDR_RESET}
differential pair; differential pair class DDR_DATA_DIF: LDQS_N, LDQS_P, UDQS_N, UDQS_P
net class DDR_DATA(8-15): DQ8, DQ9, DQ10, DQ11, DQ12, DQ13, DQ14, DQ15
net class DDR_DATA(0-7): DQ0, DQ1, DQ2, DQ3, DQ4, DQ5, DQ6, DQ7
net class DDR_CLK: CLK_N, CLK_P
net class DDR_DATA: DQ0, DQ1, DQ2, DQ3, DQ4, DQ5, DQ6, DQ7, DQ8, DQ9, DQ10, DQ11, DQ12, DQ13, DQ14, DQ15, LDM, LDQS_N, LDQS_P, UDM, UDQS_N, UDQS_P

### Notes on the sheet
- Proyect Name:
- Sheet Name:
- Drawn by:
- Revision:
- Sheet Number:
- Of
- Date:

### Library data of the parts
C69-C77 = C0402C474K8RAC: CAP CER 0.47uF 10V X7R 0402 10%; PartNumber: C0603C474K4RAC; Manufacturer: Kemet; ComponentLink1Description: DataSheet; ComponentLink1URL: https://content.kemet.com/datasheets/KEM_C1002_X7R_SMD.pdf; Size: 0402; ComponentLink2Description: DigiKey; ComponentLink2URL: https://www.digikey.com/en/products/filter/ceramic-capacitors/60?s=N4IgTCBcDaIMIAYAsCxyQdiQaQBwCUBBOEAXQF8g; ComponentLink3Description: ProductPage; ComponentLink3URL: https://www.kemet.com/en/us/product/C0805C474K4RACTU.html; Tolerance: 10%; Value: 0.47uF; Voltage: 10 V
C78 = C0402C105K4RAC: CAP CER 1uF 16V X7R 0402 10%; Manufacturer: Kemet; ComponentLink1Description: DataSheet; ComponentLink1URL: https://content.kemet.com/datasheets/KEM_C1002_X7R_SMD.pdf; Size: 0402; ComponentLink2Description: DigiKey; ComponentLink2URL: https://www.digikey.com/en/products/detail/kemet/C0402C105K4RAC7867/22058709?s=N4IgTCBcDaIMIAYAsCxwIwIKwGkkCUBBOEAXQF8g; Value: 1uF; Tolerance: 10%; Voltage: 16V; PartNumber: C0402C105K4RAC
C79 = C0402C103K4RAC: CAP CER 10nF 16V X7R 0402 10%; Manufactuer: Kemet; ComponentLink1Description: DataSheet; ComponentLink1URL: https://content.kemet.com/datasheets/KEM_C1002_X7R_SMD.pdf; ComponentLink2Description: DigiKey; ComponentLink2URL: https://www.digikey.com/en/products/filter/ceramic-capacitors/60?s=N4IgTCBcDaIMIAYAsCxwIwIMwGkkCUBBOEAXQF8g; Value: 10nF; Tolerance: 10%; Size: 0402; Voltage: 16V; PartNumber: C0402C103K4RAC
R22 R23 = CRCW04021K00FK: RES SMD 1K OHM 1% 0.063W 0402; Manufacturer: Vishay; ComponentLink1Description: DigiKey; ComponentLink1URL: https://www.digikey.com/en/products/filter/chip-resistor-surface-mount/52?s=N4IgTCBcDaIMICU4HUAMAWVYCMBpVqAYriALoC%20QA; ComponentLink2Description: DataSheet; ComponentLink2URL: https://www.vishay.com/docs/20035/dcrcwe3.pdf; Tolerance: 1%; Value: 1k; Size: 0402; Power: 0.063W; PartNumber: CRCW04021K00FK
R24 = CRCW0402240RFK: RES SMD 240 OHM 1% 1/10W 0402; Manufacturer: Vishay; PartNumber: CRCW0402240RFKEA; Power: 0.063W; ComponentLink1Description: DataSheet; ComponentLink1URL: https://www.vishay.com/docs/20035/dcrcwe3.pdf; ComponentLink2Description: DigiKey; ComponentLink2URL: https://www.digikey.com/en/products/detail/vishay-dale/CRCW0603240RFKEA/1174595; Value: 240; Tolerance: 1%; Size: 0402
U6 = DDR3 AS4C256M16D3LC: 256M x 16 bit DDR3L Synchronous DRAM (SDRAM); ComponentLink1Description: DataSheet; ComponentLink1URL: https://www.alliancememory.com/wp-content/uploads/pdf/ddr3/AllianceMemory_4G_DDR3L_AS4C256M16D3LC_March2020_Rev1.0.pdf

## Sheet Flash_Memory.SchDoc
size A4; DrawnBy: Santiago Rodriguez; Revision: V1; SheetNumber: 4; SheetTotal: 9
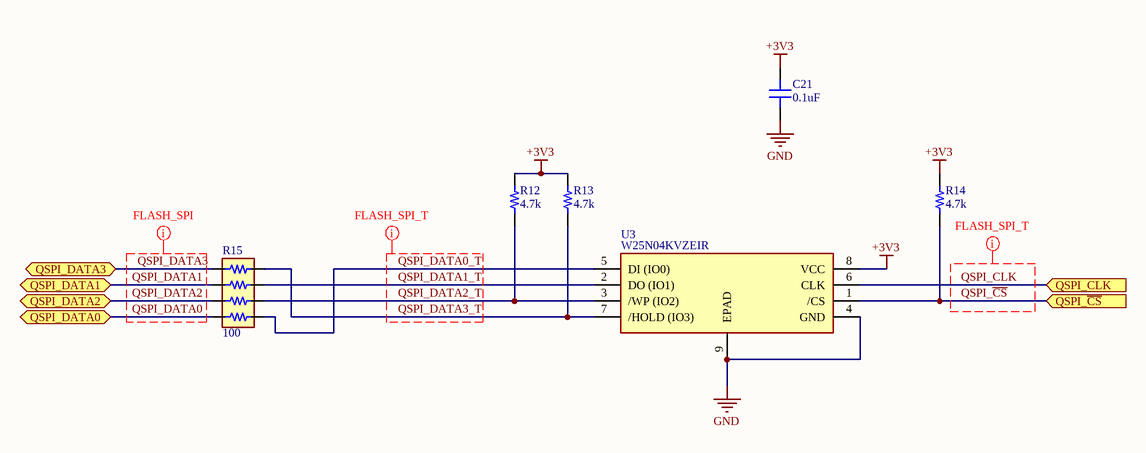
[diagram p4: Flash_Memory.SchDoc]

### Parts
C21  0.1uF  [CAP0402]
R12  4.7k  [RES0402]
R13  4.7k  [RES0402]
R14  4.7k  [RES0402]
R15  100  [ArrayResistor-1206]
U3  W25N04KVZEIR  [WSON-8]

### Ports
QSPI_CLK (in), QSPI_DATA0 (bidir), QSPI_DATA1 (bidir), QSPI_DATA2 (bidir), QSPI_DATA3 (bidir), QSPI_~{CS} (in)

### Nets
+3V3: C21.2 R12.2 R13.2 R14.2 U3.8(VCC)
GND: C21.1 U3.4(GND) U3.9(EPAD)
QSPI_~{CS}: R14.1 U3.1(/CS) ; port QSPI_~{CS}
QSPI_CLK: U3.6(CLK) ; port QSPI_CLK
QSPI_DATA0: R15.4 ; port QSPI_DATA0
QSPI_DATA0_T: R15.5 U3.5(DI_(IO0))
QSPI_DATA1: R15.2 ; port QSPI_DATA1
QSPI_DATA1_T: R15.7 U3.2(DO_(IO1))
QSPI_DATA2: R15.3 ; port QSPI_DATA2
QSPI_DATA2_T: R12.1 R15.6 U3.3(/WP_(IO2))
QSPI_DATA3: R15.1 ; port QSPI_DATA3
QSPI_DATA3_T: R13.1 R15.8 U3.7(/HOLD_(IO3))

### Layout directives
net class FLASH_SPI: QSPI_DATA0, QSPI_DATA1, QSPI_DATA2, QSPI_DATA3
net class FLASH_SPI_T: QSPI_CLK, QSPI_DATA0_T, QSPI_DATA1_T, QSPI_DATA2_T, QSPI_DATA3_T, QSPI_~{CS}

### Notes on the sheet
- Proyect Name:
- Sheet Name:
- Drawn by:
- Revision:
- Sheet Number:
- Of
- Date:

### Library data of the parts
C21 = C0402C104K4RAC: CAP CER 0.1uF 16V X7R 0402 10%; Manufactuer: Kemet; ComponentLink1Description: DataSheet; ComponentLink1URL: https://content.kemet.com/datasheets/KEM_C1002_X7R_SMD.pdf; ComponentLink2Description: DigiKey; ComponentLink2URL: https://www.digikey.com/en/products/filter/ceramic-capacitors/60?s=N4IgTCBcDaIMIAYAsCxwIzINJIEoEE4QBdAXyA; Value: 0.1uF; Tolerance: 10%; Size: 0402; Voltage: 16V; PartNumber: C0402C104K4RAC
R12-R14 = CRCW04024K70FK: RES SMD 4.7K OHM 1% 0.063W 0402; Manufacturer: Vishay; ComponentLink1Description: DataSheet; ComponentLink1URL: https://www.vishay.com/docs/20035/dcrcwe3.pdf; Size: 0402; ComponentLink2Description: DigiKey; ComponentLink2URL: https://www.digikey.com/es/products/filter/resistor-de-chip-montaje-en-superficie/52?s=N4IgTCBcDaIMICU4HUAMAWVZ0GkDsqAYjiALoC%20QA; Power: 0.063 W; PartNumber: CRCW04024K70FK; Value: 4.7k; Tolerance: 1%
R15 = EXB-38V101JV: RES ARRAY 4 RES 100 OHM 1206; Elements: 4; Value: 100 Ohms; ComponentLink1Description: DigiKey; ComponentLink1URL: https://www.digikey.com/en/products/detail/panasonic-electronic-components/EXB-38V101JV/256519?s=N4IgTCBcDaIKIA0BCBaAzADgGoEYAMOAUliALoC%2BQA; ComponentLink2Description: DataSheet; ComponentLink2URL: https://industrial.panasonic.com/cdbs/www-data/pdf/AOC0000/AOC0000C14.pdf; Size: 1206
U3 = W25N04KVZEIR: QSPINAND 4G-BIT FLASH MEMORY WITH DUAL/QUAD SPI BUFFER READ & SEQUENTIAL READ; ComponentLink1Description: Product Brief; ComponentLink1URL: https://www.winbond.com/hq/product/code-storage-flash-memory/qspinand-flash/?__locale=en&partNo=W25N04KV